# EAGLE design samotneesp (EAGLE 8.2.0)
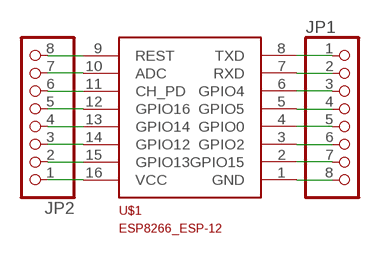
[diagram p0: schematic, sheet 1]

## Parts
JP1  PINHD-1X8  [1X08]
JP2  PINHD-1X8  [1X08]
U$1  ESP8266_ESP-12  [ESP8266-ESP12]

## Nets
N$1: JP2.8 U$1.9(REST)
N$2: JP2.7 U$1.10(ADC)
N$3: JP2.6 U$1.11(CH_PD)
N$4: JP2.5 U$1.12(GPIO16)
N$5: JP2.4 U$1.13(GPIO14)
N$6: JP2.3 U$1.14(GPIO12)
N$7: JP2.2 U$1.15(GPIO13)
N$8: JP2.1 U$1.16(VCC)
N$9: JP1.8 U$1.1(GND)
N$10: JP1.7 U$1.2(GPIO15)
N$11: JP1.6 U$1.3(GPIO2)
N$12: JP1.5 U$1.4(GPIO0)
N$13: JP1.4 U$1.5(GPIO5)
N$14: JP1.3 U$1.6(GPIO4)
N$15: JP1.2 U$1.7(RXD)
N$16: JP1.1 U$1.8(TXD)

## Library data of the parts
JP1 JP2 = pinhead:PINHD-1X8: PIN HEADER
U$1 = ESP8266-ESP12:ESP8266_ESP-12

## Board
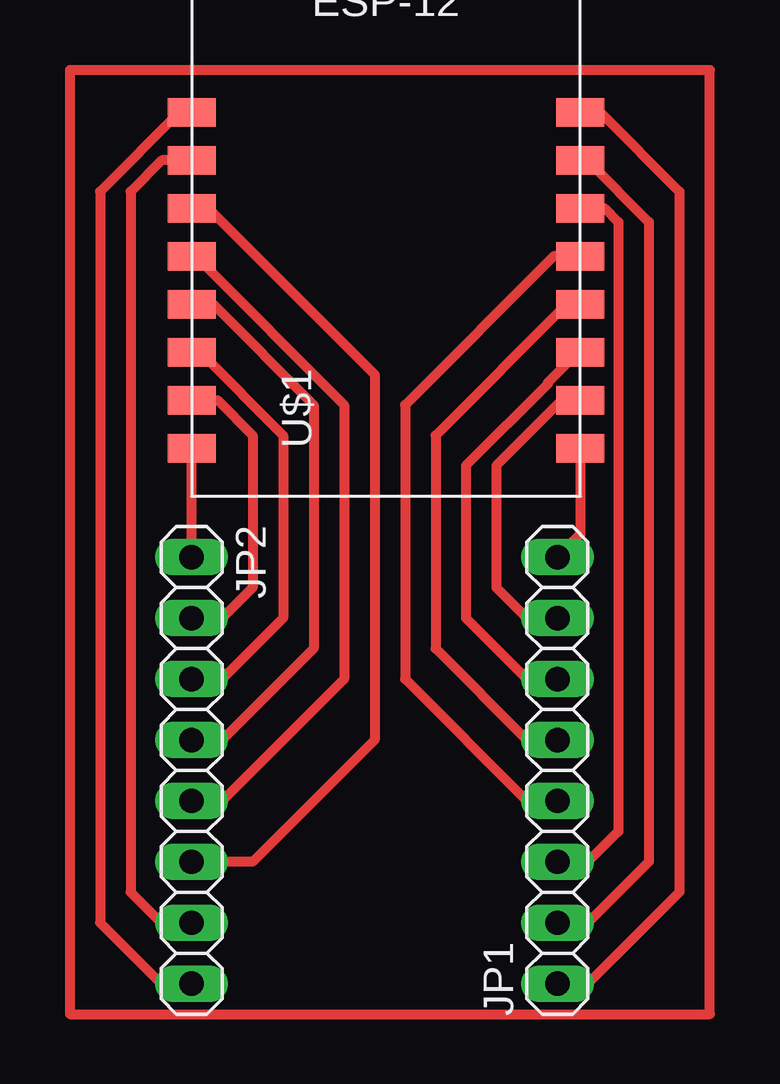
[diagram p1: board, top side]

No outline drawn. Coordinates in mm, seen from the top.
Copper layers (1*16): Top 0.035mm / dielectric 1.5mm / Bottom 0.035mm
Design rules "default": minimum track width 6mil, minimum drill 0.35mm, track to track 6mil, track to pad 6mil, pad to pad 6mil, via to via 6mil, smd to smd 6mil, copper to edge 40mil, drill to drill 6mil, minimum pad ring 10mil, minimum via ring 8mil, stop-mask expansion 4mil, vias tented up to drill 0mil, thermal gap 10mil

### Footprints (pad centres in the part's own frame; a part is rotated, then mirrored left to right if it is on the bottom)
1X08 = drill 1.016 long: 1 -8.89,0; 2 -6.35,0; 3 -3.81,0; 4 -1.27,0; 5 1.27,0; 6 3.81,0; 7 6.35,0; 8 8.89,0
ESP8266-ESP12 = smd 2 x 1.2: 1 16.2,2; 2 16.2,4; 3 16.2,6; 4 16.2,8; 5 16.2,10; 6 16.2,12; 7 16.2,14; 8 16.2,16; 9 0,16; 10 0,14; 11 0,12; 12 0,10; 13 0,8; 14 0,6; 15 0,4; 16 0,2

### Placement (x,y rotation side)
JP1  43.18,44.45 90 top
JP2  27.94,44.45 270 top
U$1  27.94,55.88 0 top

### Tracks (layer width: path | path; a pad name or v marks a point on that pad's centre or on a via)
N$1
  Top 0.406: U$1.9 27.43,71.88 24.13,68.58 24.13,38.1 26.67,35.56 JP2.8
N$2
  Top 0.406: U$1.10 26.7,69.88 25.4,68.58 25.4,39.37 26.67,38.1 JP2.7
N$3
  Top 0.406: U$1.11 28.64,67.88 35.56,60.96 35.56,45.72 30.48,40.64 JP2.6
N$4
  Top 0.406: U$1.12 28.1,65.88 34.29,59.69 34.29,48.26 29.21,43.18 JP2.5
N$5
  Top 0.406: U$1.13 28.83,63.88 33.02,59.69 33.02,49.53 29.21,45.72 JP2.4
N$6
  Top 0.406: U$1.14 28.29,61.88 31.75,58.42 31.75,50.8 29.21,48.26 JP2.3
N$7
  Top 0.406: U$1.15 29.02,59.88 30.48,58.42 30.48,52.07 29.21,50.8 JP2.2
N$8
  Top 0.406: JP2.1 U$1.16
N$9
  Top 0.406: U$1.1 44.14,54.3 JP1.8
N$10
  Top 0.406: U$1.2 43.37,59.88 40.64,57.15 40.64,52.07 41.91,50.8 JP1.7
N$11
  Top 0.406: U$1.3 44.04,61.88 42.78,60.63 42.78,60.56 39.37,57.15 39.37,50.8 41.91,48.26 JP1.6
N$12
  Top 0.406: U$1.4 43.56,63.88 38.1,58.42 38.1,49.53 41.91,45.72 JP1.5
N$13
  Top 0.406: U$1.5 43.02,65.88 36.83,59.69 36.83,48.26 41.91,43.18 JP1.4
N$14
  Top 0.406: U$1.6 45.15,67.88 45.72,67.31 45.72,41.91 44.45,40.64 JP1.3
N$15
  Top 0.406: U$1.7 44.42,69.88 46.99,67.31 46.99,40.64 44.45,38.1 JP1.2
N$16
  Top 0.406: U$1.8 44.96,71.88 48.26,68.58 48.26,39.37 44.45,35.56 JP1.1
N$17
  Top 0.406: 22.86,73.66 22.86,34.29 49.53,34.29 49.53,73.66 22.86,73.66